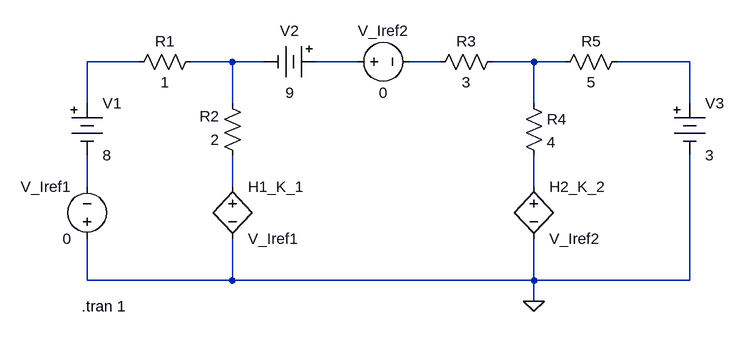
[diagram p0: schematic g3_p12.asc]
g3_p12.asc, the LTspice schematic file:
Version 4
SHEET 1 880 680
WIRE -272 96 -352 96
WIRE -128 96 -192 96
WIRE -80 96 -128 96
WIRE 64 96 0 96
WIRE 192 96 144 96
WIRE 336 96 272 96
WIRE 384 96 336 96
WIRE 576 96 464 96
WIRE -352 160 -352 96
WIRE -128 160 -128 96
WIRE 336 160 336 96
WIRE 576 160 576 96
WIRE -352 288 -352 240
WIRE -128 288 -128 240
WIRE 336 288 336 240
WIRE -352 432 -352 368
WIRE -128 432 -128 368
WIRE -128 432 -352 432
WIRE 336 432 336 368
WIRE 336 432 -128 432
WIRE 576 432 576 240
WIRE 576 432 336 432
WIRE 336 464 336 432
FLAG 336 464 0
SYMBOL Misc\\battery -352 144 R0
SYMATTR InstName V1
SYMATTR Value 8
SYMBOL Misc\\battery 16 96 R90
WINDOW 0 -32 56 VBottom 2
WINDOW 3 32 56 VTop 2
SYMATTR InstName V2
SYMATTR Value 9
SYMBOL Misc\\battery 576 144 R0
SYMATTR InstName V3
SYMATTR Value 3
SYMBOL res -176 80 R90
WINDOW 0 0 56 VBottom 2
WINDOW 3 32 56 VTop 2
SYMATTR InstName R1
SYMATTR Value 1
SYMBOL res -112 256 R180
WINDOW 0 36 76 Left 2
WINDOW 3 36 40 Left 2
SYMATTR InstName R2
SYMATTR Value 2
SYMBOL res 176 112 R270
WINDOW 0 32 56 VTop 2
WINDOW 3 0 56 VBottom 2
SYMATTR InstName R3
SYMATTR Value 3
SYMBOL res 320 144 R0
SYMATTR InstName R4
SYMATTR Value 4
SYMBOL res 480 80 R90
WINDOW 0 0 56 VBottom 2
WINDOW 3 32 56 VTop 2
SYMATTR InstName R5
SYMATTR Value 5
SYMBOL h -128 272 R0
SYMATTR InstName H1_K_1
SYMATTR Value V_Iref1
SYMATTR Value2 1
SYMBOL h 336 272 R0
SYMATTR InstName H2_K_2
SYMATTR Value V_Iref2
SYMATTR Value2 2
SYMBOL voltage -352 384 R180
WINDOW 0 24 96 Left 2
WINDOW 3 24 16 Left 2
SYMATTR InstName V_Iref1
SYMATTR Value 0
SYMBOL voltage 48 96 R270
WINDOW 0 32 56 VTop 2
WINDOW 3 -32 56 VBottom 2
SYMATTR InstName V_Iref2
SYMATTR Value 0
TEXT -360 472 Left 2 !.tran 1

The netlist it stands for:
* g3_p12.asc
V1 N001 N007 8
V2 N003 N002 9
V3 N006 0 3
R1 N002 N001 1
R2 N008 N002 2
R3 N004 N005 3
R4 N005 N009 4
R5 N006 N005 5
H1_K_1 N008 0 V_Iref1 1
H2_K_2 N009 0 V_Iref2 2
V_Iref1 0 N007 0
V_Iref2 N003 N004 0
.tran 1
.backanno
.end